# EAGLE design basicDueMega (EAGLE 6.5.0)

## Sheet 1 of 2
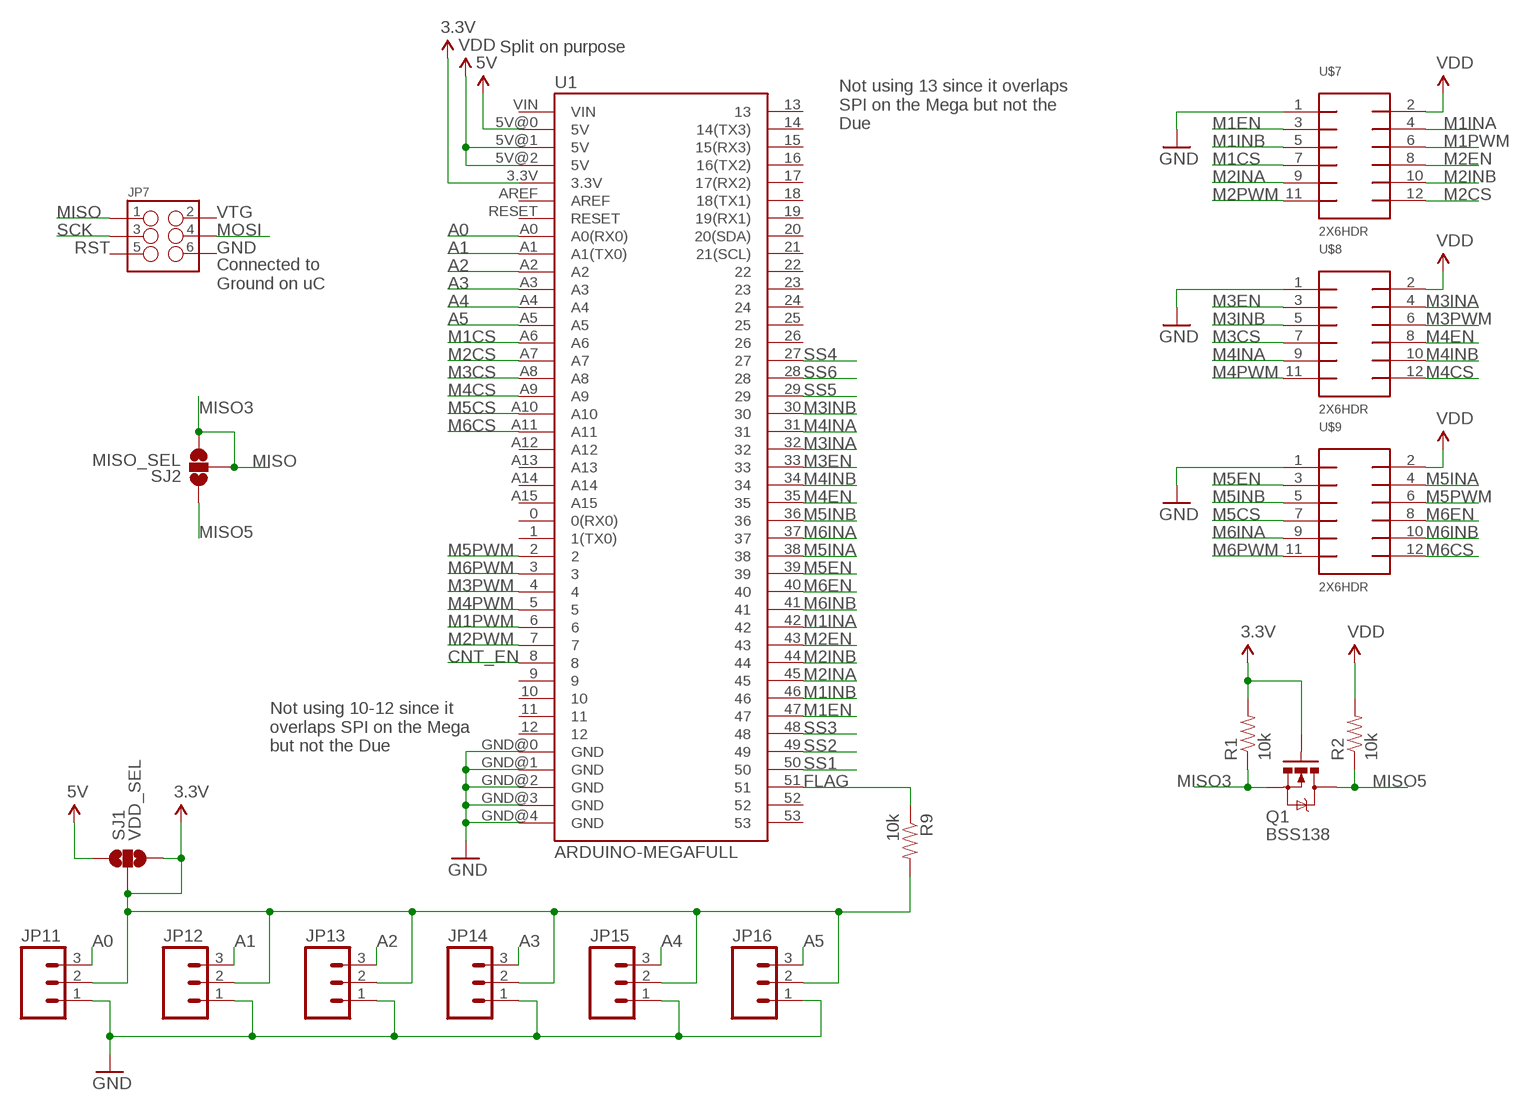
[diagram p0: schematic, sheet 1]

### Parts
JP7  M03X2POGO_PINS  [2X3_POGO]
JP11  M03LOCK  [1X03_LOCK]
JP12  M03LOCK  [1X03_LOCK]
JP13  M03LOCK  [1X03_LOCK]
JP14  M03LOCK  [1X03_LOCK]
JP15  M03LOCK  [1X03_LOCK]
JP16  M03LOCK  [1X03_LOCK]
Q1  MOSFET-NCHANNELBSS123LT1G  [SOT23]
R1  10k  RESISTOR0603-RES  [0603-RES]
R2  10k  RESISTOR0603-RES  [0603-RES]
R9  10k  RESISTOR0603-RES  [0603-RES]
SJ1  VDD_SEL  SOLDERJUMPER_2WAYT  [SJ_2]
SJ2  MISO_SEL  SOLDERJUMPER_2WAYT  [SJ_2]
U1  ARDUINO-MEGAFULL  [ARDUINO_MEGA]
U$7  2X6HDR  [2X6_2MM_SHROUD]
U$8  2X6HDR  [2X6_2MM_SHROUD]
U$9  2X6HDR  [2X6_2MM_SHROUD]

### Nets
3.3V: JP11.2 JP12.2 JP13.2 JP14.2 JP15.2 JP16.2 Q1.1(G) R1.2 R9.2 SJ1.2 SJ1.3 U1.3.3V
5V: SJ1.1 U1.5V@0(5V) ; also sheet 2
A0: JP11.3 U1.A0(A0(RX0))
A1: JP12.3 U1.A1(A1(TX0))
A2: JP13.3 U1.A2
A3: JP14.3 U1.A3
A4: JP15.3 U1.A4
A5: JP16.3 U1.A5
CNT_EN: U1.8 ; also sheet 2
FLAG: R9.1 U1.51 ; also sheet 2
GND: JP11.1 JP12.1 JP13.1 JP14.1 JP15.1 JP16.1 U1.GND@0(GND) U1.GND@1(GND) U1.GND@2(GND) U1.GND@3(GND) U1.GND@4(GND) U$7.1 U$8.1 U$9.1 ; also sheet 2
M1CS: U1.A6 U$7.7
M1EN: U1.47 U$7.3
M1INA: U1.42 U$7.4
M1INB: U1.46 U$7.5
M1PWM: U1.6 U$7.6
M2CS: U1.A7 U$7.12
M2EN: U1.43 U$7.8
M2INA: U1.45 U$7.9
M2INB: U1.44 U$7.10
M2PWM: U1.7 U$7.11
M3CS: U1.A8 U$8.7
M3EN: U1.33 U$8.3
M3INA: U1.32 U$8.4
M3INB: U1.30 U$8.5
M3PWM: U1.4 U$8.6
M4CS: U1.A9 U$8.12
M4EN: U1.35 U$8.8
M4INA: U1.31 U$8.9
M4INB: U1.34 U$8.10
M4PWM: U1.5 U$8.11
M5CS: U1.A10 U$9.7
M5EN: U1.39 U$9.3
M5INA: U1.38 U$9.4
M5INB: U1.36 U$9.5
M5PWM: U1.2 U$9.6
M6CS: U1.A11 U$9.12
M6EN: U1.40 U$9.8
M6INA: U1.37 U$9.9
M6INB: U1.41 U$9.10
M6PWM: U1.3 U$9.11
MISO3: JP7.P$1 Q1.2(S) R1.1 SJ2.2 SJ2.3
MISO5: Q1.3(D) R2.1 SJ2.1 ; also sheet 2
MOSI: JP7.P$4 ; also sheet 2
SCK: JP7.P$3 ; also sheet 2
SS1: U1.50 ; also sheet 2
SS2: U1.49 ; also sheet 2
SS3: U1.48 ; also sheet 2
SS4: U1.27 ; also sheet 2
SS5: U1.29 ; also sheet 2
SS6: U1.28 ; also sheet 2
VDD: R2.2 U1.5V@1(5V) U1.5V@2(5V) U$7.2 U$8.2 U$9.2
Unconnected: JP7.P$2 JP7.P$5 JP7.P$6 U1.0(0(RX0)) U1.1(1(TX0)) U1.9 U1.10 U1.11 U1.12 U1.13 U1.14(14(TX3)) U1.15(15(RX3)) U1.16(16(TX2)) U1.17(17(RX2)) U1.18(18(TX1)) U1.19(19(RX1)) U1.20(20(SDA)) U1.21(21(SCL)) U1.22 U1.23 U1.24 U1.25 U1.26 U1.52 U1.53 U1.A12 U1.A13 U1.A14 U1.A15 U1.AREF U1.RESET U1.VIN

### Notes on the sheet
- Split on purpose
- Not using 13 since it overlaps
  SPI on the Mega but not the
  Due
- MISO | VTG
- RST | GND
- Connected to 
  Ground on uC
- MISO
- Not using 10-12 since it 
  overlaps SPI on the Mega
  but not the Due
- BSS138

## Sheet 2 of 2: LS7366R-S
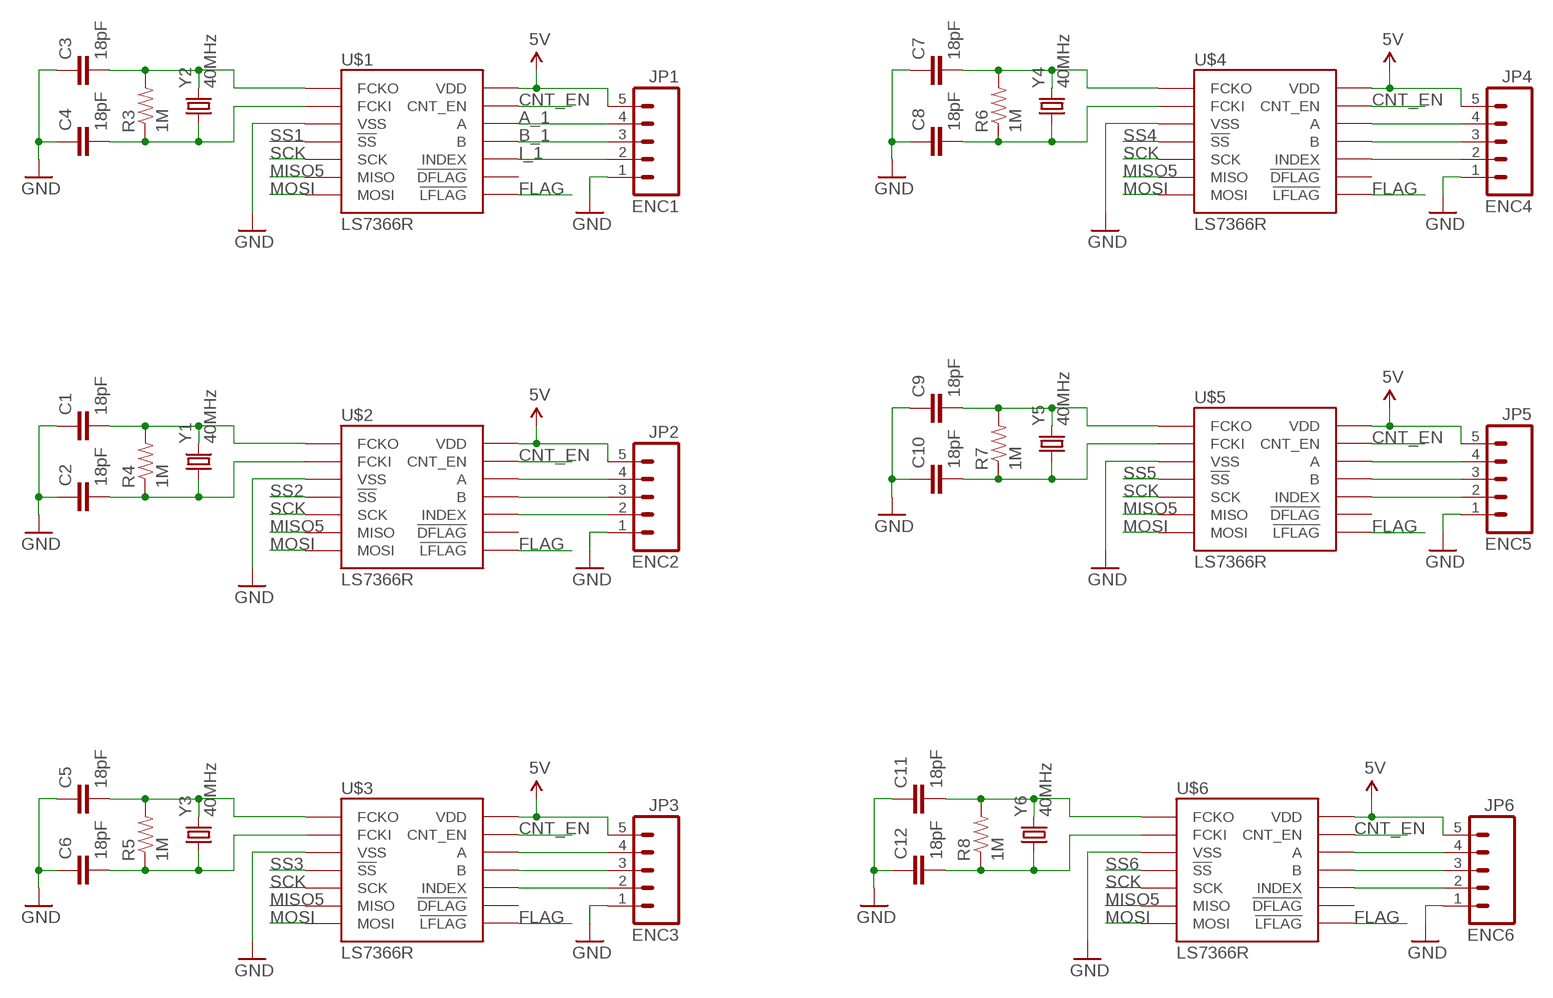
[diagram p1: schematic, sheet 2]

### Parts
C1  18pF  CAP0603-CAP  [0603-CAP]
C2  18pF  CAP0603-CAP  [0603-CAP]
C3  18pF  CAP0603-CAP  [0603-CAP]
C4  18pF  CAP0603-CAP  [0603-CAP]
C5  18pF  CAP0603-CAP  [0603-CAP]
C6  18pF  CAP0603-CAP  [0603-CAP]
C7  18pF  CAP0603-CAP  [0603-CAP]
C8  18pF  CAP0603-CAP  [0603-CAP]
C9  18pF  CAP0603-CAP  [0603-CAP]
C10  18pF  CAP0603-CAP  [0603-CAP]
C11  18pF  CAP0603-CAP  [0603-CAP]
C12  18pF  CAP0603-CAP  [0603-CAP]
JP1  ENC1  M05LOCK  [1X05_LOCK]
JP2  ENC2  M05LOCK  [1X05_LOCK]
JP3  ENC3  M05LOCK  [1X05_LOCK]
JP4  ENC4  M05LOCK  [1X05_LOCK]
JP5  ENC5  M05LOCK  [1X05_LOCK]
JP6  ENC6  M05LOCK  [1X05_LOCK]
R3  1M  RESISTOR0603-RES  [0603-RES]
R4  1M  RESISTOR0603-RES  [0603-RES]
R5  1M  RESISTOR0603-RES  [0603-RES]
R6  1M  RESISTOR0603-RES  [0603-RES]
R7  1M  RESISTOR0603-RES  [0603-RES]
R8  1M  RESISTOR0603-RES  [0603-RES]
U$1  LS7366R  [SOIC14]
U$2  LS7366R  [SOIC14]
U$3  LS7366R  [SOIC14]
U$4  LS7366R  [SOIC14]
U$5  LS7366R  [SOIC14]
U$6  LS7366R  [SOIC14]
Y1  40MHz  CRYSTAL5X3  [CRYSTAL-SMD-5X3]
Y2  40MHz  CRYSTAL5X3  [CRYSTAL-SMD-5X3]
Y3  40MHz  CRYSTAL5X3  [CRYSTAL-SMD-5X3]
Y4  40MHz  CRYSTAL5X3  [CRYSTAL-SMD-5X3]
Y5  40MHz  CRYSTAL5X3  [CRYSTAL-SMD-5X3]
Y6  40MHz  CRYSTAL5X3  [CRYSTAL-SMD-5X3]

### Nets
5V: JP1.5 JP2.5 JP3.5 JP4.5 JP5.5 JP6.5 U$1.14(VDD) U$2.14(VDD) U$3.14(VDD) U$4.14(VDD) U$5.14(VDD) U$6.14(VDD) ; also sheet 1
A_1: JP1.4 U$1.12(A)
B_1: JP1.3 U$1.11(B)
CNT_EN: U$1.13(CNT_EN) U$2.13(CNT_EN) U$3.13(CNT_EN) U$4.13(CNT_EN) U$5.13(CNT_EN) U$6.13(CNT_EN) ; also sheet 1
FLAG: U$1.8(!LFLAG) U$2.8(!LFLAG) U$3.8(!LFLAG) U$4.8(!LFLAG) U$5.8(!LFLAG) U$6.8(!LFLAG) ; also sheet 1
GND: C1.1 C2.1 C3.1 C4.1 C5.1 C6.1 C7.1 C8.1 C9.1 C10.1 C11.1 C12.1 JP1.1 JP2.1 JP3.1 JP4.1 JP5.1 JP6.1 U$1.3(VSS) U$2.3(VSS) U$3.3(VSS) U$4.3(VSS) U$5.3(VSS) U$6.3(VSS) ; also sheet 1
I_1: JP1.2 U$1.10(INDEX)
MISO5: U$1.6(MISO) U$2.6(MISO) U$3.6(MISO) U$4.6(MISO) U$5.6(MISO) U$6.6(MISO) ; also sheet 1
MOSI: U$1.7(MOSI) U$2.7(MOSI) U$3.7(MOSI) U$4.7(MOSI) U$5.7(MOSI) U$6.7(MOSI) ; also sheet 1
N$1: C3.2 R3.2 U$1.1(FCKO) Y2.3
N$2: C4.2 R3.1 U$1.2(FCKI) Y2.1
N$3: JP2.4 U$2.12(A)
N$4: JP2.3 U$2.11(B)
N$5: JP2.2 U$2.10(INDEX)
N$9: C1.2 R4.2 U$2.1(FCKO) Y1.3
N$10: C2.2 R4.1 U$2.2(FCKI) Y1.1
N$11: JP3.4 U$3.12(A)
N$12: JP3.3 U$3.11(B)
N$13: JP3.2 U$3.10(INDEX)
N$14: C5.2 R5.2 U$3.1(FCKO) Y3.3
N$15: C6.2 R5.1 U$3.2(FCKI) Y3.1
N$16: JP4.4 U$4.12(A)
N$17: JP4.3 U$4.11(B)
N$18: JP4.2 U$4.10(INDEX)
N$19: C7.2 R6.2 U$4.1(FCKO) Y4.3
N$20: C8.2 R6.1 U$4.2(FCKI) Y4.1
N$21: JP5.4 U$5.12(A)
N$22: JP5.3 U$5.11(B)
N$23: JP5.2 U$5.10(INDEX)
N$24: C9.2 R7.2 U$5.1(FCKO) Y5.3
N$25: C10.2 R7.1 U$5.2(FCKI) Y5.1
N$26: JP6.4 U$6.12(A)
N$27: JP6.3 U$6.11(B)
N$28: JP6.2 U$6.10(INDEX)
N$29: C11.2 R8.2 U$6.1(FCKO) Y6.3
N$30: C12.2 R8.1 U$6.2(FCKI) Y6.1
SCK: U$1.5(SCK) U$2.5(SCK) U$3.5(SCK) U$4.5(SCK) U$5.5(SCK) U$6.5(SCK) ; also sheet 1
SS1: U$1.4(!SS) ; also sheet 1
SS2: U$2.4(!SS) ; also sheet 1
SS3: U$3.4(!SS) ; also sheet 1
SS4: U$4.4(!SS) ; also sheet 1
SS5: U$5.4(!SS) ; also sheet 1
SS6: U$6.4(!SS) ; also sheet 1
Unconnected: U$1.9(!DFLAG) U$2.9(!DFLAG) U$3.9(!DFLAG) U$4.9(!DFLAG) U$5.9(!DFLAG) U$6.9(!DFLAG)

## Library data of the parts
C1-C12 = SparkFun-Passives:CAP: Capacitor Standard 0603 ceramic capacitor, and 0.1" leaded capacitor.
JP1-JP6 = SparkFun-Connectors:M05: Header 5 Standard 5-pin 0.1" header. Use with straight break away headers (SKU : PRT-00116), right angle break away headers (PRT-00553), swiss pins (PRT-00743), machine pins (PRT-00117), and female headers (PRT-00115). Molex polarized connector foot print use with SKU : PRT-08230 with associated crimp pins and housings.
JP7 = SparkFun-Connectors:M03X2: 2x3 .1" header. Shrouded, with keying- CONN-10681 SMT- CONN-11415 Pogo pins- HW-11044; PROD_ID: HW-11044
JP11-JP16 = SparkFun-Connectors:M03: Header 3 Standard 3-pin 0.1" header. Use with straight break away headers (SKU : PRT-00116), right angle break away headers (PRT-00553), swiss pins (PRT-00743), machine pins (PRT-00117), and female headers (PRT-00115). Molex polarized connector foot print use with SKU : PRT-08232 with associated crimp pins and housings.
Q1 = SparkFun-DiscreteSemi:MOSFET-NCHANNEL: Common NMOSFET Parts MFG P/N Store ID Prod ID FDD8780 TRANS-09984 SI7820DN TRANS-11055 FDS6630A IC-08089 2N7002PW TRANS-11151 FQP30N06L COM-10213 TRANS-10060 BSS123LT1G TRANS-08345 BSS138 TRANS-00830 BS170 2N7000; PROD_ID: TRANS-08345
R1-R9 = SparkFun-Passives:RESISTOR: Resistor Basic schematic elements and footprints for 0603, 1206, and PTH resistors.
SJ1 SJ2 = SparkFun-Passives:SOLDERJUMPER_2WAY: Solder Jumper 2 way solder jumper
U1 = SparkFun-Boards:ARDUINO-MEGA: Arduino Mega board footprint
U$1-U$6 = dCustom:LS7366R
U$7-U$9 = dCustom:2X6HDR
Y1-Y6 = SparkFun-FreqCtrl:CRYSTAL: Various standard crystals. Proven footprints. Spark Fun Electronics SKU : COM-00534

## Board
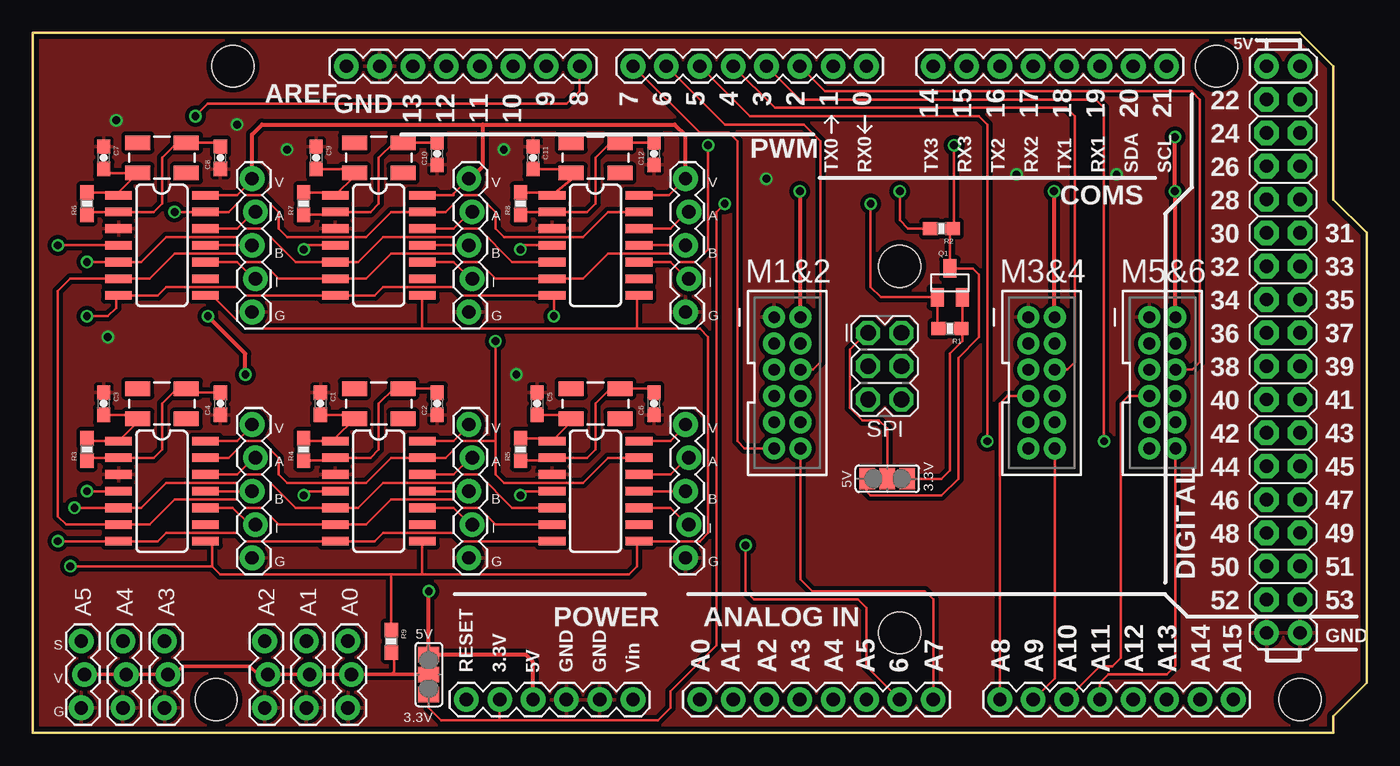
[diagram p2: board, top side]
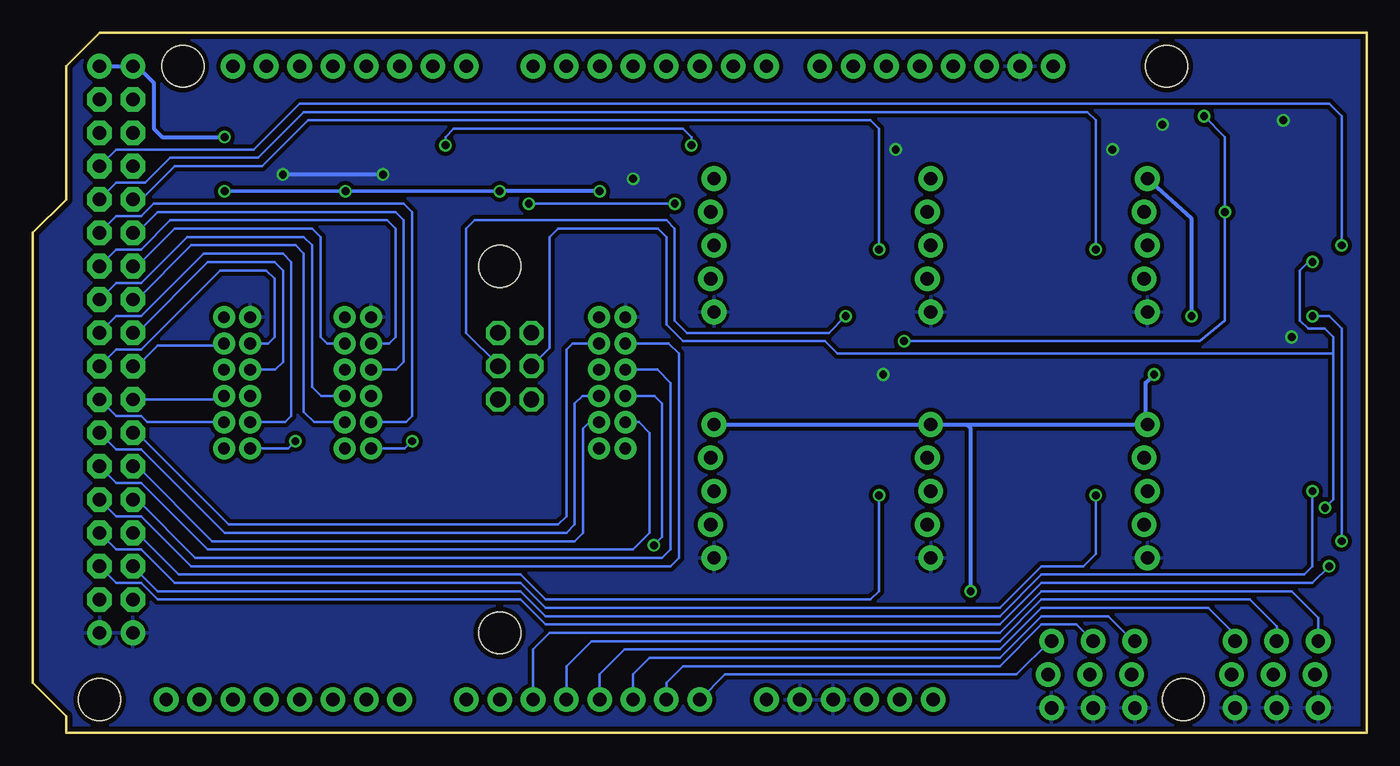
[diagram p3: board, bottom side, seen from below]

Size 101.6 x 53.34 mm. Coordinates in mm from the lower left corner, seen from the top.
Copper layers (1*16): Top 0.0356mm / dielectric 1.5011mm / Bottom 0.0356mm
Design rules "oshPark": minimum track width 6mil, minimum drill 13mil, track to track 6mil, track to pad 6mil, pad to pad 6mil, via to via 6mil, smd to smd 6mil, copper to edge 15mil, drill to drill 6mil, minimum pad ring 7mil, minimum via ring 7mil, stop-mask expansion 3mil, vias tented up to drill 0mil, thermal gap 10mil

### Footprints (pad centres in the part's own frame; a part is rotated, then mirrored left to right if it is on the bottom)
0603-CAP = smd 1.1 x 1: 1 -0.85,0; 2 0.85,0
1X05_LOCK = drill 1.016 pad 1.88: 1 0,0.127; 2 2.54,-0.127; 3 5.08,0.127; 4 7.62,-0.127; 5 10.16,0.127
2X3_POGO = drill 1.2 pad 1.829 octagon: P$1 0,0; P$2 0,2.54; P$3 2.54,0; P$4 2.54,2.54; P$5 5.08,0; P$6 5.08,2.54
1X03_LOCK = drill 1.016 pad 1.88: 1 0,0.127; 2 2.54,-0.127; 3 5.08,0.127
SOT23 = smd 1 x 1.4: 1 -0.95,-1.1; 2 0.95,-1.1; 3 0,1.1
0603-RES = smd 1.1 x 1: 1 -0.85,0; 2 0.85,0
SJ_2 = smd 1.168 x 1.6: 1 -1.524,0; 2 0,0; 3 1.524,0
ARDUINO_MEGA = drill 1.016 pad 1.88: 0 63.5,50.8; 1 60.96,50.8; 2 58.42,50.8; 3 55.88,50.8; 3.3V 35.56,2.54; 4 53.34,50.8; 5 50.8,50.8; 5V@0 38.1,2.54; 5V@1 93.98,50.8; 5V@2 96.52,50.8; 6 48.26,50.8; 7 45.72,50.8; 8 41.656,50.8; 9 39.116,50.8; 10 36.576,50.8; 11 34.036,50.8; 12 31.496,50.8; 13 28.956,50.8; 14 68.58,50.8; 15 71.12,50.8; 16 73.66,50.8; 17 76.2,50.8; 18 78.74,50.8; 19 81.28,50.8; 20 83.82,50.8; 21 86.36,50.8; A0 50.8,2.54; A1 53.34,2.54; A2 55.88,2.54; A3 58.42,2.54; A4 60.96,2.54; A5 63.5,2.54; A6 66.04,2.54; A7 68.58,2.54; A8 73.66,2.54; A9 76.2,2.54; A10 78.74,2.54; A11 81.28,2.54; A12 83.82,2.54; A13 86.36,2.54; A14 88.9,2.54; A15 91.44,2.54; AREF 23.876,50.8; GND@0 40.64,2.54; GND@1 43.18,2.54; GND@2 93.98,7.62; GND@3 96.52,7.62; GND@4 26.416,50.8; RESET 33.02,2.54; VIN 45.72,2.54 | drill 1.016 pad 1.88 octagon: 22 93.98,48.26; 23 96.52,48.26; 24 93.98,45.72; 25 96.52,45.72; 26 93.98,43.18; 27 96.52,43.18; 28 93.98,40.64; 29 96.52,40.64; 30 93.98,38.1; 31 96.52,38.1; 32 93.98,35.56; 33 96.52,35.56; 34 93.98,33.02; 35 96.52,33.02; 36 93.98,30.48; 37 96.52,30.48; 38 93.98,27.94; 39 96.52,27.94; 40 93.98,25.4; 41 96.52,25.4; 42 93.98,22.86; 43 96.52,22.86; 44 93.98,20.32; 45 96.52,20.32; 46 93.98,17.78; 47 96.52,17.78; 48 93.98,15.24; 49 96.52,15.24; 50 93.98,12.7; 51 96.52,12.7; 52 93.98,10.16; 53 96.52,10.16 | hole 3.2: 15.24,50.8; 13.97,2.54; 66.04,35.56; 66.04,7.62; 90.17,50.8; 96.52,2.54
SOIC14 = smd 2.032 x 0.66: 1 -3.315,4.445; 2 -3.315,3.175; 3 -3.315,1.905; 4 -3.315,0.635; 5 -3.315,-0.635; 6 -3.315,-1.905; 7 -3.315,-3.175; 8 3.315,-3.175; 9 3.315,-1.905; 10 3.315,-0.635; 11 3.315,0.635; 12 3.315,1.905; 13 3.315,3.175; 14 3.315,4.445
2X6_2MM_SHROUD = drill 0.9 pad 1.676: 1 -1,5; 2 1,5; 3 -1,3; 4 1,3; 5 -1,1; 6 1,1; 7 -1,-1; 8 1,-1; 9 -1,-3; 10 1,-3; 11 -1,-5; 12 1,-5
CRYSTAL-SMD-5X3 = smd 1.9 x 1.1: 1 -1.85,-1.15; 2 1.85,-1.15; 3 1.85,1.15; 4 -1.85,1.15

### Placement (x,y rotation side)
C1  21.91,25.08 270 top
C2  30.8,25.08 90 top
C3  5.4,25.08 270 top
C4  14.29,25.08 90 top
C5  38.42,25.08 270 top
C6  47.31,25.08 90 top
C7  5.4,43.81 270 top
C8  14.29,43.81 90 top
C9  21.59,43.81 270 top
C10  30.8,44.13 90 top
C11  38.1,43.81 270 top
C12  47.31,44.13 90 top
JP1  16.83,13.34 90 top
JP2  33.34,13.34 90 top
JP3  49.85,13.34 90 top
JP4  16.83,32.07 90 top
JP5  33.34,32.07 90 top
JP6  49.85,32.07 90 top
JP7  63.63,30.48 270 top
JP11  24.13,1.91 90 top
JP12  20.95,1.91 90 top
JP13  17.78,1.91 90 top
JP14  10.16,1.91 90 top
JP15  6.99,1.91 90 top
JP16  3.81,1.91 90 top
Q1  69.85,34.29 0 top
R1  69.85,30.8 180 top
R2  69.22,38.42 180 top
R3  4.13,21.59 90 top
R4  20.64,21.59 90 top
R5  37.15,21.59 90 top
R6  4.13,40.32 90 top
R7  20.64,40.32 90 top
R8  37.15,40.32 90 top
R9  27.3,6.99 270 top
SJ1  30.16,4.45 270 top
SJ2  65.09,19.37 0 top
U1  0,0 0 top
U$1  9.84,17.78 0 top
U$2  26.35,17.78 0 top
U$3  42.86,17.78 0 top
U$4  9.84,36.51 0 top
U$5  26.35,36.51 0 top
U$6  42.86,36.51 0 top
U$7  57.47,26.67 0 top
U$8  76.83,26.67 0 top
U$9  86.04,26.67 0 top
Y1  26.35,25.08 180 top
Y2  9.84,25.08 180 top
Y3  42.86,25.08 180 top
Y4  9.84,43.81 180 top
Y5  26.35,43.81 180 top
Y6  42.86,43.81 180 top

### Tracks (layer width: path | path; a pad name or v marks a point on that pad's centre or on a via)
3.3V  (via drill 0.6, 0.6 pad 0.61)
  Top 0.203: R9.2 27.51,5.93 27.51,4.65 27.3,4.45 | 35.56,0.95 31.11,0.95 30.16,1.91 SJ1.3 SJ1.2 | 35.56,0.95 47.62,0.95 48.58,1.91 48.58,3.17 52.07,6.67 52.07,39.69 v52.7,40.32 | U1.3.3V 35.56,0.95 | Q1.1 | R1.2 68.9,30.8 Q1.1 | Q1.1 64.6,33.19 63.82,33.97 v63.82,40.32
  Top 0.254: SJ1.2 27.3,4.45 JP11.2 JP12.2 JP13.2 17.14,4.45 16.51,5.08 11.43,5.08 10.79,4.45 JP14.2 JP15.2 JP16.2
  Bottom 0.203: v52.7,40.32 v63.82,40.32
5V  (via drill 0.6 pad 0.61)
  Top 0.203: JP4.5 16.7,42.1 15.56,40.96 U$4.14 | JP2.5 33.21,23.37 32.07,22.23 U$2.14 | U$5.14 32.07,40.96 32.07,41.08 JP5.5 | JP1.5 16.7,23.37 15.56,22.23 U$1.14 | 49.72,23.37 JP3.5 | 49.72,23.37 48.58,22.23 U$3.14 | 49.72,23.37 49.85,23.5 49.53,23.5 | U$6.14 48.45,40.96 JP6.5
  Top 0.305: v16.19,27.3 16.19,28.89 v13.34,31.75 | U1.5V@0 38.1,5.4 37.53,5.97 SJ1.1 v30.16,10.79 | 16.7,42.1 16.7,45.59 17.46,46.35 34.29,46.35 | 34.29,46.35 48.9,46.35 49.72,45.53 JP6.5 | JP5.5 33.34,42.23 34.29,43.18 34.29,46.35
  Bottom 0.203: JP3.5 49.85,23.5
  Bottom 0.305: JP1.5 16.83,23.5 | 49.85,23.5 JP2.5 30.48,23.5 | 30.48,23.5 16.83,23.5 | 16.83,23.5 16.83,26.67 v16.19,27.3 | v13.34,31.75 13.34,39.18 JP4.5 | v30.16,10.79 30.16,23.18 30.48,23.5
A0
  Bottom 0.203: JP11.3 24.13,6.99 26.67,4.45 48.9,4.45 U1.A0
A1
  Bottom 0.203: U1.A1 53.34,3.81 52.07,5.08 27.94,5.08 24.77,8.26 22.1,8.26 JP12.3
A2
  Bottom 0.203: JP13.3 17.78,6.99 19.68,8.89 24.77,8.89 27.94,5.71 54.61,5.71 55.88,4.45 U1.A2
A3
  Bottom 0.203: JP14.3 10.03,7.49 12.06,9.53 24.77,9.53 27.94,6.35 56.52,6.35 58.42,4.45 U1.A3
A4
  Bottom 0.203: JP15.3 6.86,8.13 8.89,10.16 24.77,10.16 27.94,6.99 59.05,6.99 60.96,5.08 U1.A4
A5
  Bottom 0.203: U1.A5 63.5,6.35 62.23,7.62 27.94,7.62 24.77,10.79 5.71,10.79 3.68,8.76 JP16.3
A_1
  Top 0.203: JP1.4 16.83,20.95 15.56,19.68 U$1.12
B_1
  Top 0.203: U$1.11 JP1.3
CNT_EN  (via drill 0.6, 0.6 pad 0.61)
  Top 0.203: U$1.13 14.92,20.95 16.19,22.23 17.46,22.23 18.73,20.95 18.73,19.68 19.37,19.05 25.4,19.05 27.3,20.95 U$2.13 31.43,20.95 32.7,22.23 35.24,22.23 | U$3.13 43.81,20.95 41.91,19.05 35.88,19.05 35.24,19.68 35.24,22.23 | U$6.13 43.81,39.69 41.91,37.78 35.88,37.78 35.24,38.42 35.24,39.69 33.97,40.96 32.7,40.96 31.43,39.69 U$5.13 27.3,39.69 25.4,37.78 19.37,37.78 18.73,38.42 18.73,39.69 17.46,40.96 16.19,40.96 14.92,39.69 U$4.13 v10.79,39.69 | U1.8 41.66,48.9 40.64,47.94 13.34,47.94 v12.38,46.99 | 35.24,22.23 v35.24,29.84
  Bottom 0.203: 18.1,29.84 v35.24,29.84 12.7,29.84 10.79,31.43 v10.79,39.69 10.79,45.4 v12.38,46.99
FLAG  (via drill 0.6 pad 0.61)
  Top 0.203: U$1.8 13.65,14.61 13.65,12.7 | 27.3,12.06 14.29,12.06 13.65,12.7 | 27.3,12.06 29.53,12.06 | 29.53,12.06 45.4,12.06 46.04,12.7 46.04,14.46 U$3.8 50.8,14.61 51.44,15.24 51.44,30.16 50.8,30.8 46.04,30.8 | U$2.8 29.67,12.21 29.53,12.06 | U$4.8 13.65,33.34 16.19,30.8 29.53,30.8 | 29.53,30.8 46.04,30.8 | 46.04,30.8 46.04,33.16 U$6.8 | R9.1 27.3,12.06 | U$5.8 29.67,30.94 29.53,30.8 | v2.86,12.7 13.65,12.7
  Bottom 0.203: U1.51 95.25,11.43 93.34,11.43 92.08,10.16 64.45,10.16 62.55,8.26 27.94,8.26 24.77,11.43 4.13,11.43 v2.86,12.7
GND  (via drill 0.6, 0.6 pad 0.61)
  Bottom 0.305: v74.93,42.55 v82.55,42.55
  other vias: 36.83,27.3 5.71,30.16 6.35,46.67 19.37,44.45 35.88,44.45 55.88,42.23 15.56,46.35
  pour Bottom (isolate 0.305, rank 6): 0,53.34 0,0 101.6,0 101.6,38.1 101.6,40.64 99.06,40.64 99.06,53.34
  pour Top (isolate 0.305, rank 6): 0,53.34 101.6,53.34 101.6,0 0,0
I_1
  Top 0.203: JP1.2 16.51,15.88 15.24,17.14 U$1.10
M1CS  (via drill 0.6)
  Top 0.203: U1.A6 63.5,5.08 63.5,9.53 62.87,10.16 54.93,10.16 54.29,10.79 v54.29,14.29
  Bottom 0.203: U$7.7 54.24,25.67 53.66,25.08 53.66,14.92 v54.29,14.29
M1EN
  Bottom 0.203: U1.47 95.25,16.51 93.34,16.51 89.53,12.7 53.02,12.7 52.39,13.34 52.39,28.89 53.16,29.67 U$7.3
M1INA
  Bottom 0.203: U1.42 93.66,22.86 86.68,15.88 61.59,15.88 60.96,16.51 60.96,29.21 60.5,29.67 U$7.4
M1INB
  Bottom 0.203: U1.46 93.66,17.78 89.22,13.34 53.66,13.34 53.02,13.97 53.02,26.67 54.02,27.67 U$7.5
M1PWM
  Top 0.203: U1.6 52.7,46.35 58.74,46.35 60.01,45.09 60.01,28.26 59.42,27.67 U$7.6
M2CS
  Top 0.203: U1.A7 68.58,10.16 67.94,10.79 59.37,10.79 58.47,11.7 U$7.12
M2EN
  Bottom 0.203: U1.43 95.25,21.59 93.34,21.59 87,15.24 60.96,15.24 60.33,15.88 60.33,25.08 59.74,25.67 U$7.8
M2INA
  Bottom 0.203: U1.45 95.25,19.05 93.34,19.05 88.27,13.97 55.88,13.97 54.61,15.24 54.61,22.86 55.42,23.67 U$7.9
M2INB
  Bottom 0.203: U1.44 93.66,20.32 87.95,14.61 60.33,14.61 59.69,15.24 59.69,23.18 59.2,23.67 U$7.10
M2PWM
  Top 0.203: U1.7 50.8,45.72 53.02,45.72 53.66,45.09 53.66,22.23 54.21,21.67 U$7.11
M3CS
  Top 0.203: U1.A8 73.66,25.08 74.25,25.67 U$8.7
M3EN
  Bottom 0.203: U1.33 95.25,36.83 93.34,36.83 91.12,39.05 74.61,39.05 73.98,38.42 73.98,30.16 74.47,29.67 U$8.3
M3INA
  Bottom 0.203: U1.32 93.66,35.56 90.81,38.42 80.33,38.42 79.69,37.78 79.69,30.16 79.2,29.67 U$8.4
M3INB
  Bottom 0.203: U1.30 93.66,38.1 92.08,39.69 73.98,39.69 73.34,39.05 73.34,28.26 73.93,27.67 U$8.5
M3PWM
  Top 0.203: U1.4 56.52,47.62 78.74,47.62 79.38,46.99 79.38,28.26 78.79,27.67 U$8.6
M4CS
  Top 0.203: U$8.12 77.83,4.17 U1.A9
M4EN
  Bottom 0.203: U1.35 95.25,34.29 93.34,34.29 89.85,37.78 80.96,37.78 80.33,37.15 80.33,26.35 79.64,25.67 U$8.8
M4INA
  Bottom 0.203: U1.31 95.25,39.37 93.34,39.37 92.39,40.32 73.34,40.32 72.71,39.69 72.71,24.13 73.17,23.67 U$8.9
M4INB
  Bottom 0.203: U1.34 93.66,33.02 89.53,37.15 81.6,37.15 80.96,36.51 80.96,24.45 80.19,23.67 U$8.10
M4PWM  (via drill 0.6)
  Top 0.203: U1.5 54.61,46.99 72.07,46.99 72.71,46.35 v72.71,22.23
  Bottom 0.203: U$8.11 73.26,21.67 v72.71,22.23
M5CS
  Top 0.203: U1.A10 81.28,5.08 82.23,5.08 82.87,5.71 82.87,25.08 83.45,25.67 U$9.7
M5EN
  Bottom 0.203: U1.39 95.25,29.21 93.34,29.21 87.31,35.24 83.82,35.24 83.19,34.61 83.19,30.16 83.68,29.67 U$9.3
M5INA
  Bottom 0.203: U1.38 93.66,27.94 92.08,29.53 87.19,29.53 U$9.4
M5INB
  Bottom 0.203: U1.36 93.66,30.48 88.27,35.88 83.19,35.88 82.55,35.24 82.55,28.26 83.14,27.67 U$9.5
M5PWM
  Top 0.203: U1.2 60.33,48.9 88.27,48.9 88.9,48.26 88.9,28.26 88.31,27.67 U$9.6
M6CS
  Top 0.203: U$9.12 87.04,5.13 86.36,4.45 81.92,4.45 81.28,3.81 U1.A11
M6EN
  Bottom 0.203: U1.40 87.31,25.4 U$9.8
M6INA
  Bottom 0.203: U1.37 95.25,31.75 93.34,31.75 88.58,36.51 82.55,36.51 81.92,35.88 81.92,24.13 82.38,23.67 U$9.9
M6INB
  Bottom 0.203: U1.41 95.25,24.13 93.34,24.13 92.89,23.67 U$9.10
M6PWM  (via drill 0.6)
  Top 0.203: U1.3 58.42,48.26 80.96,48.26 81.6,47.62 v81.6,22.23
  Bottom 0.203: U$9.11 82.15,21.67 v81.6,22.23
MISO3
  Top 0.203: R1.1 70.8,30.9 Q1.2 70.8,30.8 70.8,29.84 69.85,28.89 69.85,20 69.22,19.37 SJ2.3 SJ2.2 65.09,23.18 64.45,23.81 63.18,23.81 62.23,24.77 62.23,29.21 63.5,30.48 JP7.P$1
MISO5  (via drill 0.6)
  Top 0.203: U$3.6 35.24,15.88 33.97,17.14 32.7,17.14 32.07,17.78 27.3,17.78 25.4,15.88 U$2.6 18.73,15.88 17.46,17.14 16.19,17.14 15.56,17.78 10.79,17.78 8.89,15.88 U$1.6 2.54,15.88 1.91,16.51 1.91,33.66 2.86,34.61 U$4.6 8.89,34.61 10.79,36.51 15.56,36.51 16.19,35.88 17.46,35.88 18.73,34.61 U$5.6 25.4,34.61 27.3,36.51 32.07,36.51 32.7,35.88 33.97,35.88 35.24,34.61 U$6.6 41.91,34.61 43.81,36.51 48.58,36.51 49.21,35.88 50.48,35.88 51.44,36.83 v51.44,44.77 | v70.17,44.77 70.17,38.52 R2.1 69.85,38.2 Q1.3 71.61,35.39 72.07,34.92 72.07,30.16 70.48,28.57 70.48,19.37 69.22,18.1 63.82,18.1 63.5,18.41 63.5,19.3 SJ2.1
  Bottom 0.203: v51.44,44.77 51.44,45.4 52.07,46.04 69.53,46.04 70.17,45.4 v70.17,44.77
MOSI  (via drill 0.6 pad 0.61)
  Top 0.203: U$3.7 32.7,14.61 32.07,15.24 26.67,15.24 26.04,14.61 U$2.7 16.19,14.61 15.56,15.24 10.16,15.24 9.53,14.61 U$1.7 v1.91,14.61 | v39.69,31.75 39.69,33.2 U$6.7 32.7,33.34 32.07,33.97 26.67,33.97 26.04,33.34 U$5.7 16.19,33.34 15.56,33.97 10.16,33.97 9.53,33.34 U$4.7 6.35,33.16 6.35,32.38 5.71,31.75 v4.13,31.75
  Bottom 0.203: JP7.P$4 66.17,28.07 68.58,30.48 68.58,38.42 67.94,39.05 53.34,39.05 52.7,38.42 52.7,31.43 51.75,30.48 40.96,30.48 v39.69,31.75 | v1.91,14.61 1.91,30.8 2.86,31.75 v4.13,31.75
N$1
  Top 0.203: R3.2 4.13,22.23 U$1.1 7.71,23.41 | 7.71,23.41 7.99,23.69 Y2.3 7.69,24.23 C3.2 | 7.71,23.41 7.71,23.58 7.94,23.81
N$2
  Top 0.203: R3.1 4.13,20.95 U$1.2 9.21,20.95 9.84,21.59 9.84,25.08 10.99,26.23 Y2.1 11.99,25.93 C4.2
N$3
  Top 0.203: JP2.4 33.34,20.95 32.07,19.68 U$2.12
N$4
  Top 0.203: JP2.3 U$2.11
N$5
  Top 0.203: JP2.2 33.34,15.88 32.07,17.14 U$2.10
N$9
  Top 0.203: R4.2 20.85,22.23 U$2.1 23.04,22.47 Y1.3 24.2,24.23 C1.2
N$10
  Top 0.203: R4.1 22.82,20.74 U$2.2 25.72,20.95 26.35,21.59 26.35,25.08 27.5,26.23 Y1.1 30.5,26.23 C2.2
N$11
  Top 0.203: JP3.4 49.85,20.95 48.58,19.68 U$3.12
N$12
  Top 0.203: JP3.3 U$3.11
N$13
  Top 0.203: JP3.2 49.85,15.88 48.58,17.14 U$3.10
N$14
  Top 0.203: R5.2 39.33,22.44 U$3.1 41.01,23.69 Y3.3 40.71,24.23 C5.2
N$15
  Top 0.203: R5.1 39.33,20.74 U$3.2 42.23,20.95 42.86,21.59 42.86,25.08 44.01,26.23 Y3.1 47.01,26.23 C6.2
N$16
  Top 0.203: JP4.4 16.83,39.69 15.56,38.42 U$4.12
N$17
  Top 0.203: U$4.11 JP4.3
N$18
  Top 0.203: JP4.2 16.83,34.61 15.56,35.88 U$4.10
N$19
  Top 0.203: R6.2 6.31,41.17 | 6.31,41.17 U$4.1 | C7.2 5.7,42.66 Y4.3 6.5,41.17 6.31,41.17
N$20
  Top 0.203: R6.1 4.34,39.69 U$4.2 9.21,39.69 9.84,40.32 9.84,43.81 10.99,44.97 Y4.1 13.99,44.97 C8.2
N$21
  Top 0.203: JP5.4 33.34,39.69 32.07,38.42 U$5.12
N$22
  Top 0.203: JP5.3 U$5.11
N$23
  Top 0.203: JP5.2 33.34,34.61 32.07,35.88 U$5.10
N$24
  Top 0.203: R7.2 22.82,41.17 U$5.1 24.5,42.42 Y5.3 24.2,42.97 C9.2
N$25
  Top 0.203: R7.1 22.82,39.47 U$5.2 25.72,39.69 26.35,40.32 26.35,43.81 27.5,44.97 Y5.1 30.78,44.97 C10.2
N$26
  Top 0.203: JP6.4 49.85,39.69 48.58,38.42 U$6.12
N$27
  Top 0.203: JP6.3 U$6.11
N$28
  Top 0.203: JP6.2 49.85,34.61 48.58,35.88 U$6.10
N$29
  Top 0.203: R8.2 39.33,41.17 U$6.1 41.33,42.42 Y6.3 40.71,42.97 C11.2
N$30
  Top 0.203: R8.1 37.25,39.16 37.15,39.69 U$6.2 42.23,39.69 42.86,40.32 42.86,43.81 44.01,44.97 Y6.1 47.29,44.97 C12.2
SCK  (via drill 0.6 pad 0.61)
  Top 0.203: U$6.5 36.51,35.88 33.97,38.42 32.7,38.42 32.07,37.78 26.67,37.78 24.77,35.88 U$5.5 20,35.88 17.46,38.42 16.19,38.42 15.56,37.78 10.16,37.78 8.26,35.88 U$4.5 v4.13,35.88 | U$3.5 36.51,17.14 33.97,19.68 32.7,19.68 32.07,19.05 26.67,19.05 24.77,17.14 U$2.5 20,17.14 17.46,19.68 16.19,19.68 15.56,19.05 10.16,19.05 8.26,17.14 U$1.5 v3.17,17.14
  Bottom 0.203: v3.17,17.14 2.54,17.78 2.54,28.89 | 2.54,28.89 2.54,30.16 3.17,30.8 4.45,30.8 5.08,31.43 5.08,35.24 4.45,35.88 v4.13,35.88 | 2.54,28.89 40.32,28.89 41.27,29.84 52.07,29.84 53.34,31.11 53.34,37.78 53.98,38.42 61.59,38.42 62.23,37.78 62.23,29.34 JP7.P$3
SS1  (via drill 0.6)
  Top 0.203: U$1.4 v4.13,18.41
  Bottom 0.203: U1.50 92.08,10.79 64.45,10.79 62.55,8.89 27.94,8.89 24.77,12.06 4.76,12.06 4.13,12.7 v4.13,18.41
SS2  (via drill 0.6)
  Top 0.203: U$2.4 20.95,18.41 v20.64,18.1
  Bottom 0.203: U1.49 95.25,13.97 93.34,13.97 90.81,11.43 64.45,11.43 62.55,9.53 27.94,9.53 24.77,12.7 21.59,12.7 20.64,13.65 v20.64,18.1
SS3  (via drill 0.6)
  Top 0.203: U$3.4 37.47,18.41 v37.15,18.1
  Bottom 0.203: U1.48 93.66,15.24 90.49,12.06 64.45,12.06 62.55,10.16 37.78,10.16 37.15,10.79 v37.15,18.1
SS4  (via drill 0.6)
  Top 0.203: U$4.4 v1.91,37.15
  Bottom 0.203: U1.27 95.25,44.45 84.77,44.45 81.28,47.94 2.86,47.94 1.91,46.99 v1.91,37.15
SS5  (via drill 0.6)
  Top 0.203: U$5.4 20.95,37.15 v20.64,36.83
  Bottom 0.203: U1.29 95.25,41.91 93.03,41.91 91.12,43.81 84.45,43.81 80.96,47.31 21.27,47.31 20.64,46.67 v20.64,36.83
SS6  (via drill 0.6)
  Top 0.203: U$6.4 37.47,37.15 v37.15,36.83
  Bottom 0.203: U1.28 93.34,40.64 90.81,43.18 84.14,43.18 80.64,46.67 37.78,46.67 37.15,46.04 v37.15,36.83
VDD  (via drill 0.6, 0.6 pad 0.61)
  Top 0.203: R2.2 66.67,38.42 66.04,39.05 v66.04,41.27
  Top 0.305: v87,45.4 v87,41.27 87.04,41.23 U$9.2 | v58.42,41.27 58.42,31.72 U$7.2 | v77.79,41.27 77.79,31.72 U$8.2
  Bottom 0.254: v66.04,41.27 v77.79,41.27 v87,41.27
  Bottom 0.305: v58.42,41.27 v66.04,41.27 | U1.5V@2 U1.5V@1 93.66,50.8 92.39,49.53 92.39,46.04 91.76,45.4 v87,45.4

### Text on the board
tPlace: M1&2 | M3&4 | M5&6
tNames: V | V | V | A | A | A | B | B | B | I | I | I | G | G | G | SPI | V | V | V | A | A | A | 5V | 3.3V | B | B | B | I | I | I | G | G | G | A5 | A4 | A3 | A2 | A1 | A0 | 5V | S | V | 3.3V | G
tValues: P. R. Diefenderfer 2014 | Overdrive Basic rev.2